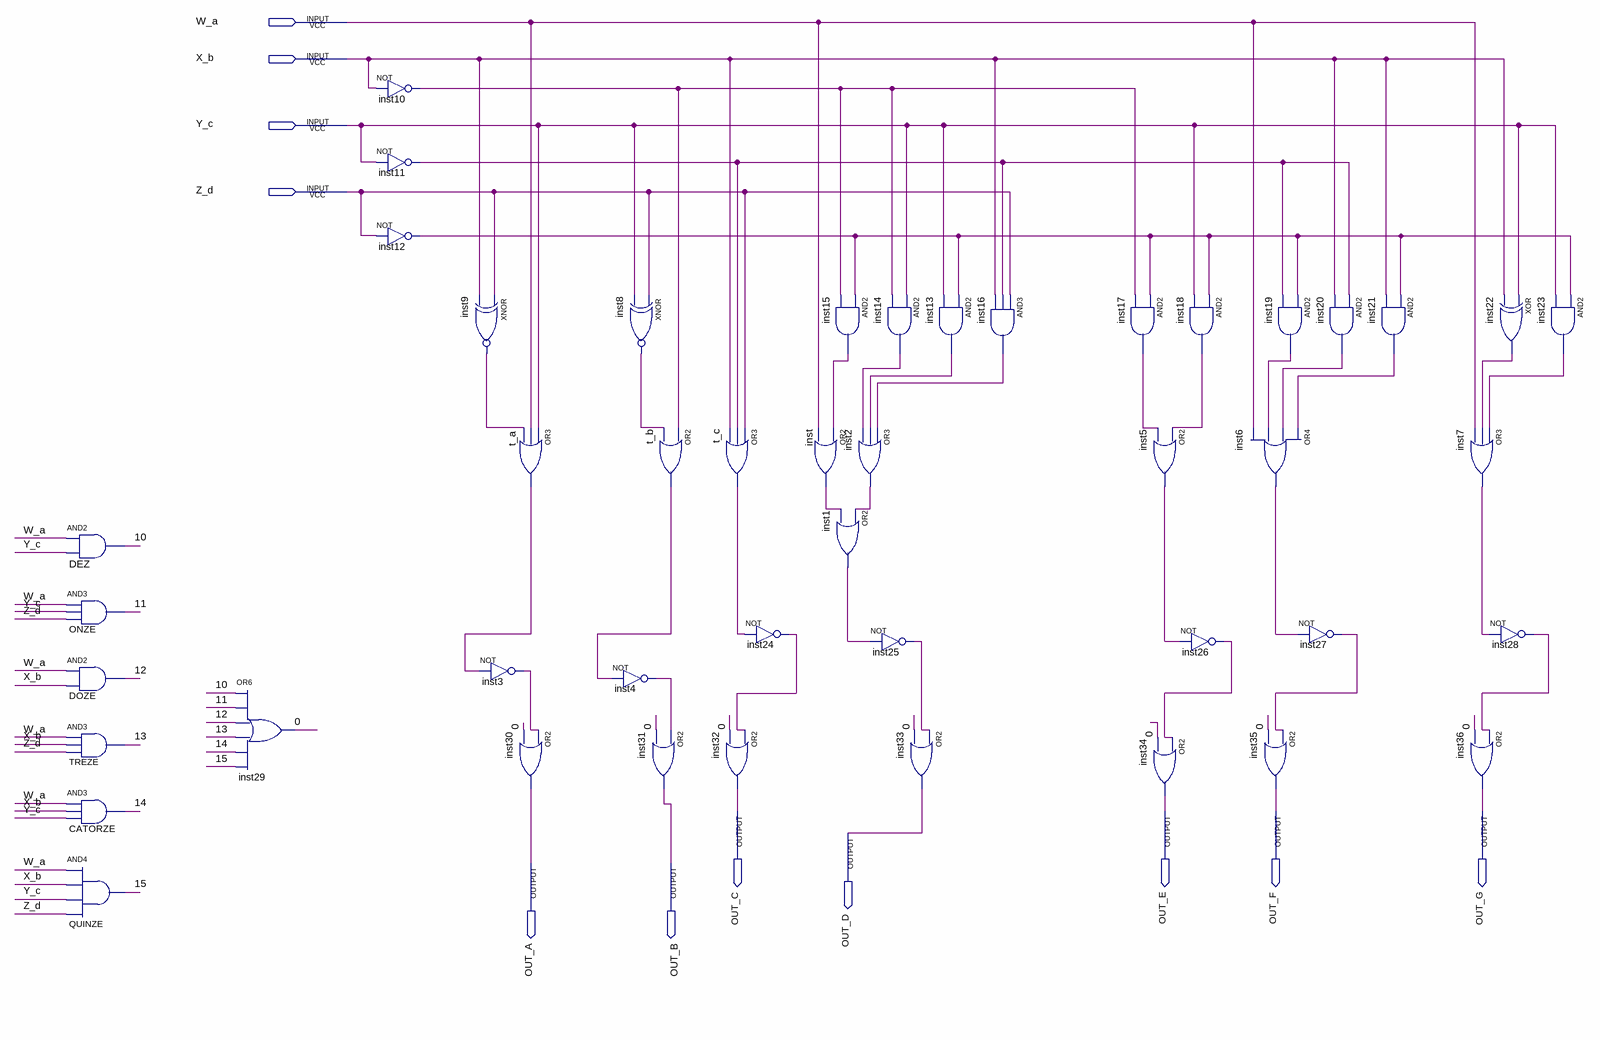
[diagram p0: schematic sheet]
// Quartus schematic Display_7_Segmentos.bdf as structural Verilog: 46 symbols, 11 pins
module Display_7_Segmentos (
  input  W_a,
  input  X_b,
  input  Y_c,
  input  Z_d,
  output OUT_C,
  output OUT_E,
  output OUT_F,
  output OUT_G,
  output OUT_D,
  output OUT_A,
  output OUT_B
);

  wire \0 , \10 , \11 , \12 , \13 , \14 , \15 , inst1_out, inst2_out, inst3_out, inst4_out, inst5_out,
       inst6_out, inst7_out, inst8_out, inst9_out, inst10_out, inst11_out, inst12_out, inst13_out,
       inst14_out, inst15_out, inst16_out, inst17_out, inst18_out, inst19_out, inst20_out, inst21_out,
       inst22_out, inst23_out, inst24_out, inst25_out, inst26_out, inst27_out, inst28_out, inst_out, t_a_out,
       t_b_out, t_c_out;

  and DEZ (\10 , W_a, Y_c);
  and ONZE (\11 , W_a, Y_c, Z_d);
  and DOZE (\12 , W_a, X_b);
  and TREZE (\13 , W_a, X_b, Z_d);
  and CATORZE (\14 , W_a, X_b, Y_c);
  and QUINZE (\15 , W_a, X_b, Y_c, Z_d);
  or inst29 (\0 , \10 , \11 , \12 , \13 , \14 , \15 );
  not inst10 (inst10_out, X_b);
  not inst11 (inst11_out, Y_c);
  not inst12 (inst12_out, Z_d);
  xnor inst9 (inst9_out, Z_d, X_b);
  or t_a (t_a_out, Y_c, W_a, inst9_out);
  not inst3 (inst3_out, t_a_out);
  or inst30 (OUT_A, inst3_out, \0 );
  xnor inst8 (inst8_out, Z_d, Y_c);
  not inst4 (inst4_out, t_b_out);
  or t_b (t_b_out, inst10_out, inst8_out);
  or inst31 (OUT_B, inst4_out, \0 );
  or t_c (t_c_out, Z_d, inst11_out, X_b);
  not inst24 (inst24_out, t_c_out);
  or inst32 (OUT_C, inst24_out, \0 );
  or inst (inst_out, inst15_out, W_a);
  and inst15 (inst15_out, inst12_out, inst10_out);
  or inst2 (inst2_out, inst16_out, inst13_out, inst14_out);
  or inst1 (inst1_out, inst2_out, inst_out);
  and inst14 (inst14_out, Y_c, inst10_out);
  not inst25 (inst25_out, inst1_out);
  or inst33 (OUT_D, inst25_out, \0 );
  and inst13 (inst13_out, inst12_out, Y_c);
  and inst16 (inst16_out, Z_d, inst11_out, X_b);
  and inst17 (inst17_out, inst12_out, inst10_out);
  or inst5 (inst5_out, inst18_out, inst17_out);
  or inst34 (OUT_E, inst26_out, \0 );
  and inst18 (inst18_out, inst12_out, Y_c);
  not inst26 (inst26_out, inst5_out);
  and inst19 (inst19_out, inst12_out, inst11_out);
  or inst6 (inst6_out, inst21_out, inst20_out, inst19_out, W_a);
  or inst35 (OUT_F, inst27_out, \0 );
  and inst20 (inst20_out, inst11_out, X_b);
  not inst27 (inst27_out, inst6_out);
  and inst21 (inst21_out, inst12_out, X_b);
  xor inst22 (inst22_out, Y_c, X_b);
  or inst7 (inst7_out, inst23_out, inst22_out, W_a);
  not inst28 (inst28_out, inst7_out);
  or inst36 (OUT_G, inst28_out, \0 );
  and inst23 (inst23_out, inst12_out, Y_c);
endmodule
